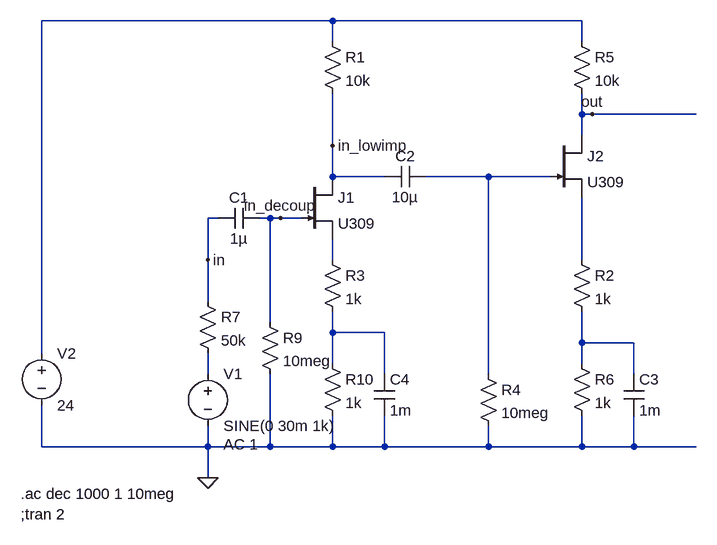
[diagram p0: schematic amp_labor2_2fet.asc]
amp_labor2_2fet.asc, the LTspice schematic file:
Version 4
SHEET 1 880 936
WIRE -144 160 -496 160
WIRE -48 160 -144 160
WIRE 336 160 -48 160
WIRE -48 192 -48 160
WIRE 336 192 336 160
WIRE 336 304 336 272
WIRE 352 304 336 304
WIRE 432 304 352 304
WIRE 512 304 432 304
WIRE 336 336 336 304
WIRE -48 352 -48 272
WIRE -48 400 -48 352
WIRE 0 400 -48 400
WIRE 32 400 0 400
WIRE 192 400 96 400
WIRE 240 400 192 400
WIRE 288 400 240 400
WIRE -224 464 -240 464
WIRE -144 464 -160 464
WIRE -128 464 -144 464
WIRE -96 464 -128 464
WIRE 336 512 336 432
WIRE -240 528 -240 464
WIRE -48 528 -48 496
WIRE 336 528 336 512
WIRE -240 592 -240 528
WIRE -144 624 -144 464
WIRE -48 640 -48 608
WIRE 32 640 -48 640
WIRE 336 656 336 608
WIRE 416 656 336 656
WIRE -496 672 -496 160
WIRE -48 688 -48 640
WIRE 336 688 336 656
WIRE -240 704 -240 672
WIRE 32 704 32 640
WIRE 192 704 192 400
WIRE 416 704 416 656
WIRE -496 816 -496 752
WIRE -240 816 -240 784
WIRE -240 816 -496 816
WIRE -144 816 -144 704
WIRE -144 816 -240 816
WIRE -48 816 -48 768
WIRE -48 816 -144 816
WIRE 32 816 32 768
WIRE 32 816 -48 816
WIRE 192 816 192 784
WIRE 192 816 32 816
WIRE 336 816 336 768
WIRE 336 816 192 816
WIRE 416 816 416 768
WIRE 416 816 336 816
WIRE 512 816 416 816
WIRE -240 864 -240 816
FLAG -240 864 0
FLAG 352 304 out
FLAG -240 528 in
FLAG -128 464 in_decoup
FLAG -48 352 in_lowimp
DATAFLAG 432 304 ""
DATAFLAG 0 400 ""
DATAFLAG 240 400 ""
DATAFLAG 336 512 ""
DATAFLAG -144 160 ""
SYMBOL res 176 688 R0
SYMATTR InstName R4
SYMATTR Value 10meg
SYMBOL res 320 176 R0
SYMATTR InstName R5
SYMATTR Value 10k
SYMBOL res 320 672 R0
SYMATTR InstName R6
SYMATTR Value 1k
SYMBOL cap -160 448 R90
WINDOW 0 0 32 VBottom 2
WINDOW 3 32 32 VTop 2
SYMATTR InstName C1
SYMATTR Value 1µ
SYMBOL voltage -240 688 R0
WINDOW 123 24 124 Left 2
WINDOW 39 0 0 Left 2
SYMATTR Value2 AC 1
SYMATTR InstName V1
SYMATTR Value SINE(0 30m 1k)
SYMBOL voltage -496 656 R0
WINDOW 123 0 0 Left 2
WINDOW 39 0 0 Left 2
SYMATTR InstName V2
SYMATTR Value 24
SYMBOL res -256 576 R0
SYMATTR InstName R7
SYMATTR Value 50k
SYMBOL njf -96 400 R0
SYMATTR InstName J1
SYMATTR Value U309
SYMBOL res -160 608 R0
SYMATTR InstName R9
SYMATTR Value 10meg
SYMBOL res -64 672 R0
SYMATTR InstName R10
SYMATTR Value 1k
SYMBOL njf 288 336 R0
SYMATTR InstName J2
SYMATTR Value U309
SYMBOL res -64 176 R0
SYMATTR InstName R1
SYMATTR Value 10k
SYMBOL cap 32 416 R270
WINDOW 0 32 32 VTop 2
WINDOW 3 0 32 VBottom 2
SYMATTR InstName C2
SYMATTR Value 10µ
SYMBOL res 320 512 R0
SYMATTR InstName R2
SYMATTR Value 1k
SYMBOL cap 400 704 R0
SYMATTR InstName C3
SYMATTR Value 1m
SYMBOL res -64 512 R0
SYMATTR InstName R3
SYMATTR Value 1k
SYMBOL cap 16 704 R0
SYMATTR InstName C4
SYMATTR Value 1m
TEXT -528 888 Left 2 !.ac dec 1000 1 10meg
TEXT -528 920 Left 2 !;tran 2

The netlist it stands for:
* amp_labor2_2fet.asc
R4 N002 0 10meg
R5 N001 out 10k
R6 N006 0 1k
C1 in_decoup in 1µ
V1 N007 0 SINE(0 30m 1k) AC 1
V2 N001 0 24
R7 in N007 50k
J1 in_lowimp in_decoup N004 U309
R9 in_decoup 0 10meg
R10 N005 0 1k
J2 out N002 N003 U309
R1 N001 in_lowimp 10k
C2 in_lowimp N002 10µ
R2 N003 N006 1k
C3 N006 0 1m
R3 N004 N005 1k
C4 N005 0 1m
.model NJF NJF
.model PJF PJF
.lib standard.jft
.ac dec 1000 1 10meg
;tran 2
.backanno
.end